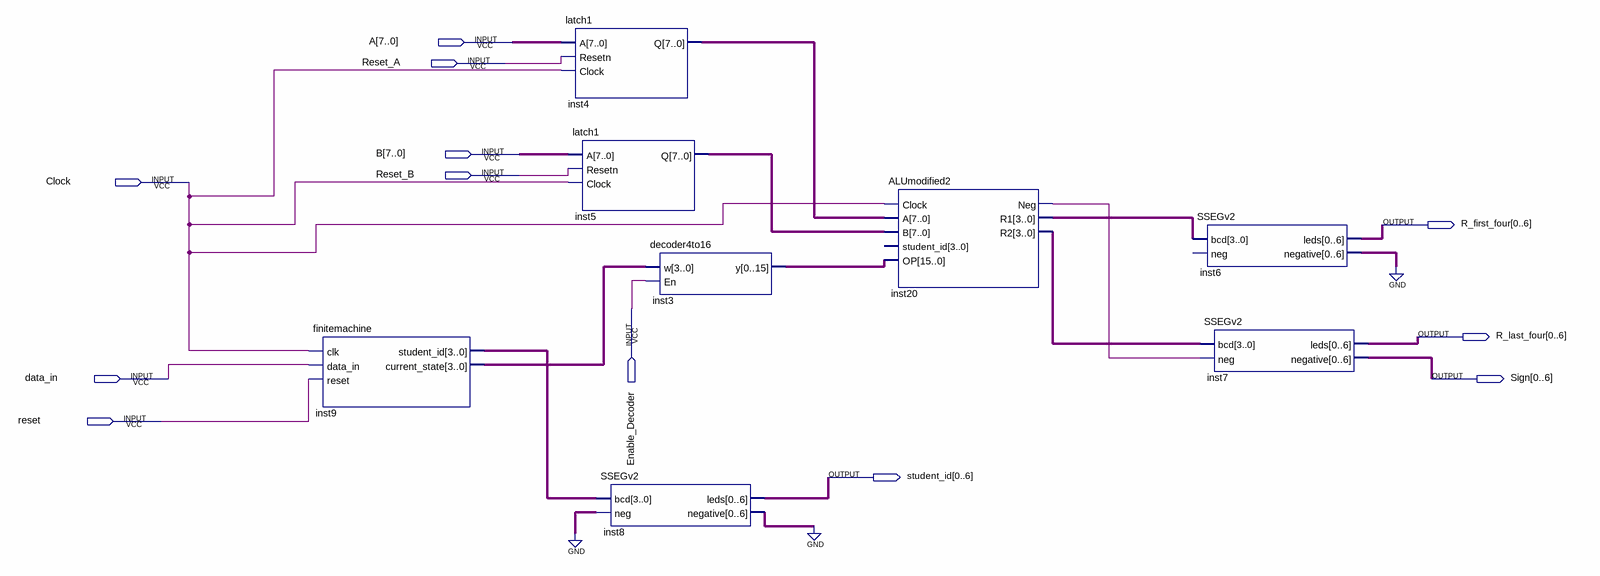
[diagram p0: schematic sheet]
// Quartus schematic Lab6problem2.bdf as structural Verilog: 8 symbols, 12 pins
module Lab6problem2 (
  input  [7:0] A,
  input  Reset_A,
  input  [7:0] B,
  input  Reset_B,
  input  Clock,
  input  Enable_Decoder,
  input  data_in,
  input  reset,
  output [0:6] R_first_four,
  output [0:6] R_last_four,
  output [0:6] Sign,
  output [0:6] student_id
);

  wire inst20_neg;
  wire [3:0] inst9_current_state, inst9_student_id, inst20_r1, inst20_r2;
  wire [6:0] inst6_negative, inst8_negative;
  wire [7:0] inst4_q, inst5_q;
  wire [15:0] inst3_y;

  finitemachine inst9 (
    .clk(Clock), .data_in(data_in), .reset(reset), .student_id(inst9_student_id),
    .current_state(inst9_current_state));
  latch1 inst4 (.A(A), .Resetn(Reset_A), .Clock(Clock), .Q(inst4_q));
  latch1 inst5 (.A(B), .Resetn(Reset_B), .Clock(Clock), .Q(inst5_q));
  SSEGv2 inst8 (.bcd(inst9_student_id), .neg(1'b0), .leds(student_id), .negative(inst8_negative));
  decoder4to16 inst3 (.w(inst9_current_state), .En(Enable_Decoder), .y(inst3_y));
  ALUmodified2 inst20 (
    .Clock(Clock), .A(inst4_q), .B(inst5_q), .OP(inst3_y), .Neg(inst20_neg), .R1(inst20_r1), .R2(inst20_r2));  // open: student_id
  SSEGv2 inst6 (.bcd(inst20_r1), .leds(R_first_four), .negative(inst6_negative));  // open: neg
  SSEGv2 inst7 (.bcd(inst20_r2), .neg(inst20_neg), .leds(R_last_four), .negative(Sign));
  // also tied to GND on the sheet: {inst6_negative[0], inst6_negative[1], inst6_negative[2], inst6_negative[3], inst6_negative[4], inst6_negative[5], inst6_negative[6], inst8_negative[0], inst8_negative[1], inst8_negative[2], inst8_negative[3], inst8_negative[4], inst8_negative[5], inst8_negative[6]}
endmodule
